# EAGLE board Speed Reg (EAGLE 5.11), part 1 of 2
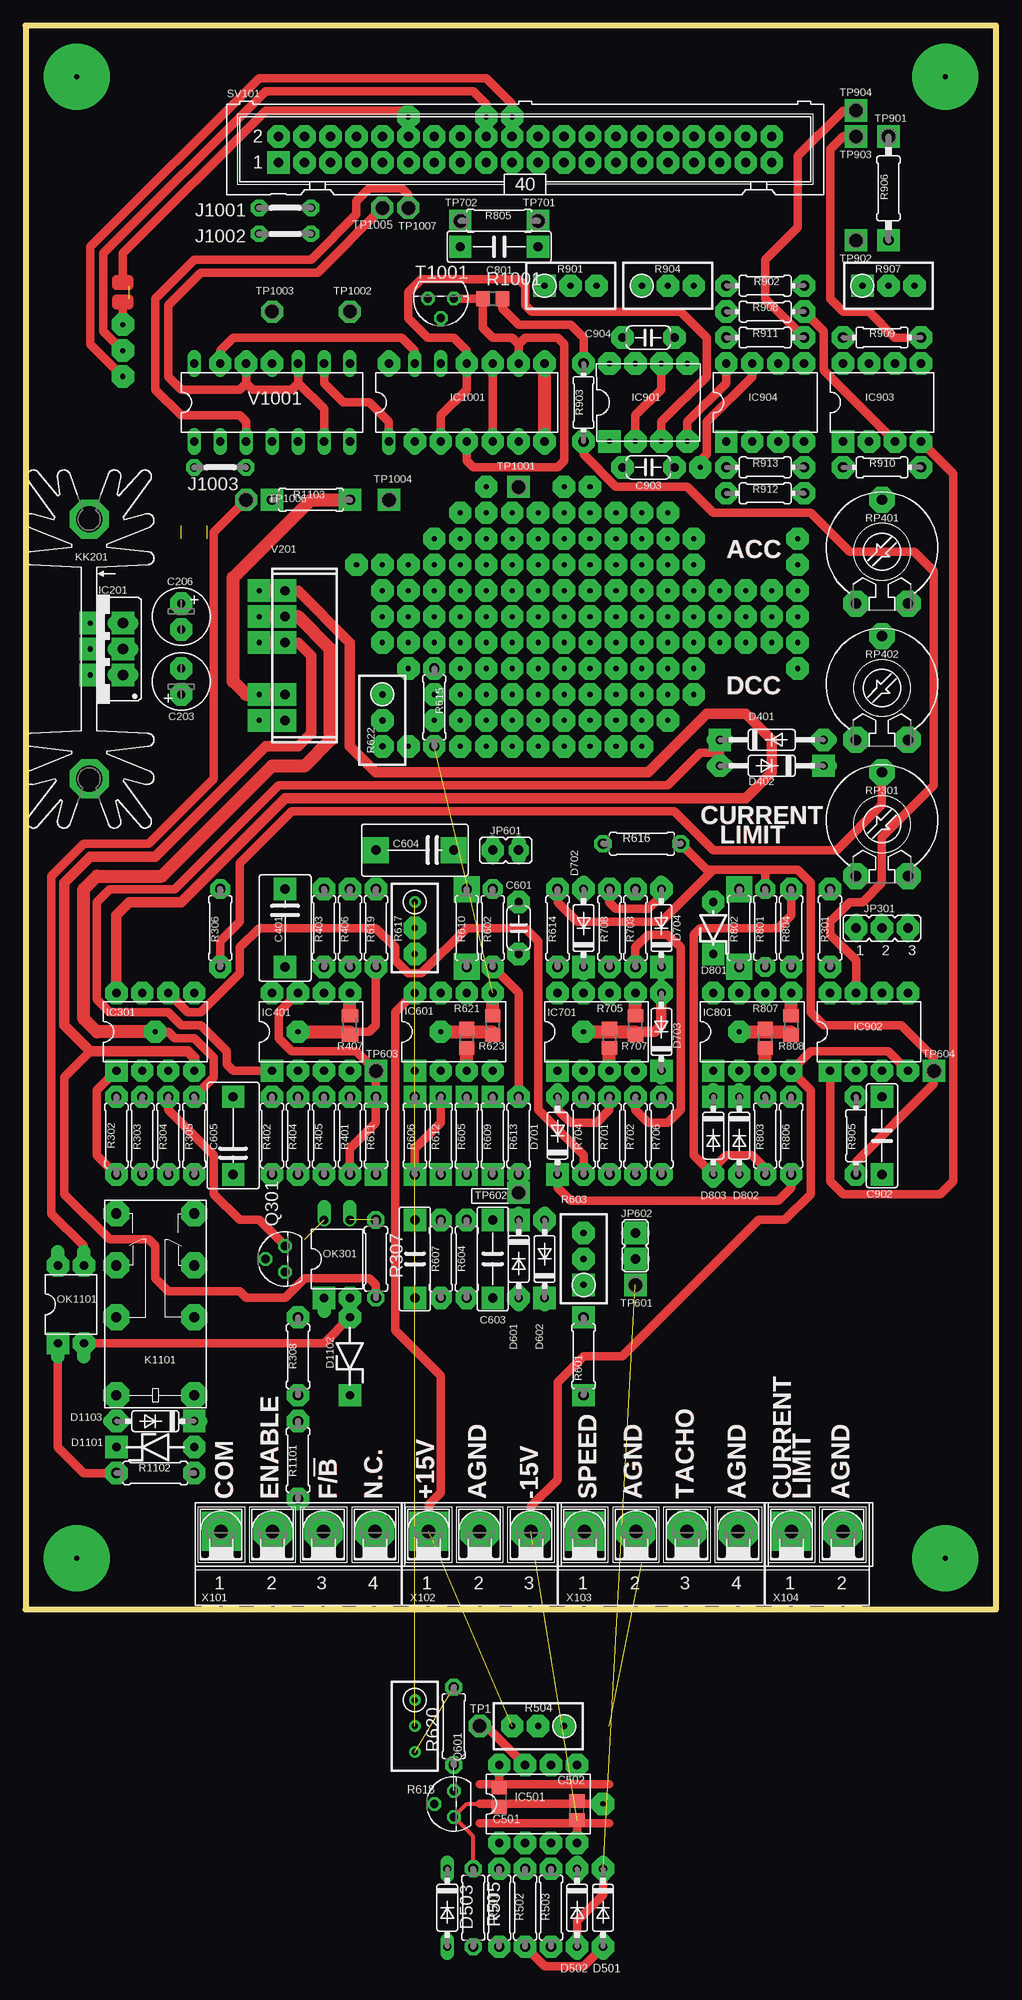
[diagram p11: board, top side]
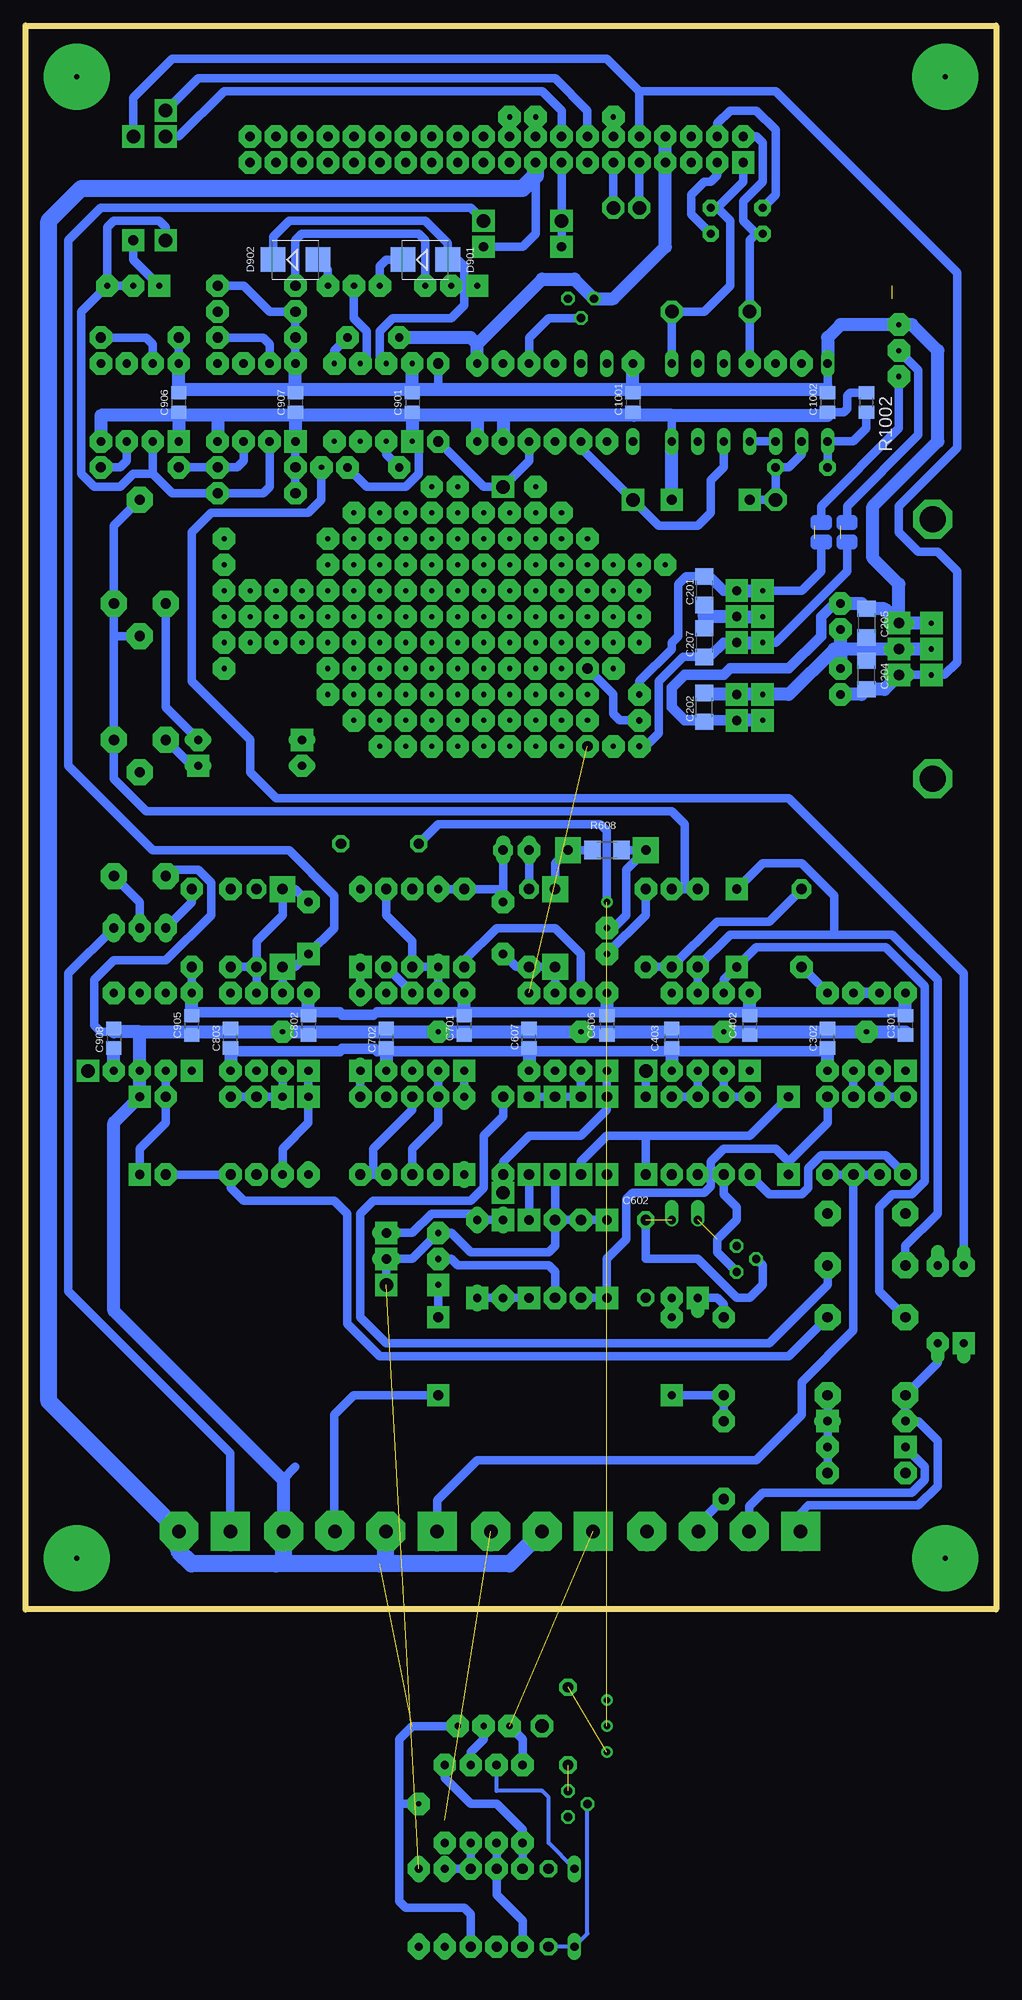
[diagram p12: board, bottom side, seen from below]

Size 95 x 155 mm. Coordinates in mm from the lower left corner, seen from the top.
Outline: 0,0 95,0 95,155 0,155 0,0
Copper layers (1*16): Top 0.035mm / dielectric 1.5mm / Bottom 0.035mm
Design rules "default": minimum track width 10mil, minimum drill 24mil, track to track 8mil, track to pad 8mil, pad to pad 8mil, via to via 8mil, smd to smd 8mil, copper to edge 40mil, drill to drill 8mil, minimum pad ring 10mil, minimum via ring 8mil, stop-mask expansion 4mil, vias tented up to drill 0mil, thermal gap 10mil

## Footprints (pad centres in the part's own frame; a part is rotated, then mirrored left to right if it is on the bottom)
C1206 = smd 1.6 x 1.8: 1 -1.4,0; 2 1.4,0
E2,5-6 = drill 0.813 pad 1.6 round: + -1.27,0 | drill 0.813 pad 1.6 octagon: - 1.27,0
C0805 = smd 1.3 x 1.5: 1 -0.95,0; 2 0.95,0
C075-052X106 = drill 0.914 octagon: 1 -3.81,0; 2 3.81,0
C050-024X044 = drill 0.813 octagon: 1 -2.54,0; 2 2.54,0
C075-032X103 = drill 0.914 octagon: 1 -3.81,0; 2 3.81,0
DO35-10 = drill 0.813 long: A 5.08,0; C -5.08,0
DO35-7 = drill 0.813 long: A 3.81,0; C -3.81,0
ZDIO-5 = drill 0.813 octagon: A 2.54,0; C -2.54,0
SMB = smd 2.4 x 2.4: A 2.2,0; C -2.2,0
ZDIO-7.5 = drill 0.813 octagon: A 3.81,0; C -3.81,0
78XXS = drill 1.016 long: GND 0,-2.54; IN -2.54,-2.54; OUT 2.54,-2.54
DIL08 = drill 0.813 pad 1.27 round: 1 -3.81,-3.81; 2 -1.27,-3.81; 3 1.27,-3.81; 4 3.81,-3.81; 5 3.81,3.81; 6 1.27,3.81; 7 -1.27,3.81; 8 -3.81,3.81
DIL8-HOME = drill 0.5 pad 2.184 square: 1 -3.81,-3.81 | drill 0.5 pad 2.184 octagon: 2 -1.27,-3.81; 3 1.27,-3.81; 4 3.81,-3.81; 5 3.81,3.81; 6 1.27,3.81; 7 -1.27,3.81; 8 -3.81,3.81
DIL14 = drill 0.813 long: 1 -7.62,-3.81; 2 -5.08,-3.81; 3 -2.54,-3.81; 4 0,-3.81; 5 2.54,-3.81; 6 5.08,-3.81; 7 7.62,-3.81; 8 7.62,3.81; 9 5.08,3.81; 10 2.54,3.81; 11 0,3.81; 12 -2.54,3.81; 13 -5.08,3.81; 14 -7.62,3.81
05 = drill 0.813 pad 1.6 octagon: 1 -2.54,0; 2 2.54,0
JP2 = drill 0.914 long: 1 -2.54,0; 2 0,0; 3 2.54,0
JP1 = drill 0.914 long: 1 0,-1.27; 2 0,1.27
G5V-2 = drill 1 pad 1.8 round: 1 -8.89,-3.81; 4 -1.27,-3.81; 6 3.81,-3.81; 8 8.89,-3.81; 9 8.89,3.81; 11 3.81,3.81; 13 -1.27,3.81; 16 -8.89,3.81
SK104-PAD = drill 2.54 pad 3.81 round: K1 -12.7,-0.762; K2 12.7,-0.762
DIL04 = drill 0.813 offset: 1 -1.27,-3.81; 2 1.27,-3.81; 3 1.27,3.81; 4 -1.27,3.81
TO92 = drill 0.813 octagon: 1 1.27,0; 2 0,1.905; 3 -1.27,0
0207/7 = drill 1 pad 1.676 octagon: 1 -3.81,0; 2 3.81,0
M0805 = smd 1.3 x 1.6: 1 -0.95,0; 2 0.95,0
RTRIM3296W = drill 0.61 round: 1 0,-2.54; 2 0,0; 3 0,2.54
R1206 = smd 1.6 x 1.803: 1 -1.422,0; 2 1.422,0
R0805 = smd 1.3 x 1.5: 1 -0.95,0; 2 0.95,0
0204/7 = drill 1 octagon: 1 -3.81,0; 2 3.81,0
0207/10 = drill 1 octagon: 1 -5.08,0; 2 5.08,0
PT-10 = drill 1.016 pad 1.778 octagon: 1 -2.54,-5.08; 2 2.54,-5.08; 3 0,5.08
ML40 = drill 0.914 octagon: 1 -24.13,-1.27; 2 -24.13,1.27; 3 -21.59,-1.27; 4 -21.59,1.27; 5 -19.05,-1.27; 6 -19.05,1.27; 7 -16.51,-1.27; 8 -16.51,1.27; 9 -13.97,-1.27; 10 -13.97,1.27; 11 -11.43,-1.27; 12 -11.43,1.27; 13 -8.89,-1.27; 14 -8.89,1.27; 15 -6.35,-1.27; 16 -6.35,1.27; 17 -3.81,-1.27; 18 -3.81,1.27; 19 -1.27,-1.27; 20 -1.27,1.27; 21 1.27,-1.27; 22 1.27,1.27; 23 3.81,-1.27; 24 3.81,1.27; 25 6.35,-1.27; 26 6.35,1.27; 27 8.89,-1.27; 28 8.89,1.27; 29 11.43,-1.27; 30 11.43,1.27; 31 13.97,-1.27; 32 13.97,1.27; 33 16.51,-1.27; 34 16.51,1.27; 35 19.05,-1.27; 36 19.05,1.27; 37 21.59,-1.27; 38 21.59,1.27; 39 24.13,-1.27; 40 24.13,1.27
P1-13 = drill 1.321 pad 2.159 octagon: TP 0,0
TMA_DUAL = drill 0.9 round: 1 -5.08,0; 2 -2.54,0; 5 2.54,0; 6 5.08,0; 7 7.62,0
AK500/4-H = drill 1.321 long: 1 -7.518,0; 2 -2.489,0; 3 2.489,0; 4 7.518,0
AK500/3-H = drill 1.321 long: 1 -5.004,0; 2 0,0; 3 5.004,0
AK500/2-H = drill 1.321 long: 1 -2.515,0; 2 2.515,0

## Placement (x,y rotation side)
C201  [C1206]  28.57,99.69 270 bottom
C202  [C1206]  28.57,88.27 90 bottom
C203  [E2,5-6]  15.24,90.81 90 top
C204  [C1206]  12.7,91.44 90 bottom
C205  [C1206]  12.7,96.52 270 bottom
C206  [E2,5-6]  15.24,97.16 270 top
C207  [C1206]  28.57,94.61 270 bottom
C301  100nF  [C0805]  8.89,57.15 270 bottom
C302  100nF  [C0805]  16.51,55.88 90 bottom
C401  1uF  [C075-052X106]  25.4,66.67 270 top
C402  100nF  [C0805]  24.13,57.15 270 bottom
C403  100nF  [C0805]  31.75,55.88 90 bottom
C501  100nF  [C0805]  46.35,-18.41 270 top  (outside the outline)
C502  100nF  [C0805]  53.98,-19.68 90 top  (outside the outline)
C601  3.3nF  [C050-024X044]  48.26,66.67 90 top
C602  220nF  [C075-032X103]  38.1,34.29 90 top
C603  10nF  [C075-032X103]  45.72,34.29 90 top
C604  200nF  [C075-052X106]  38.1,74.3 180 top
C605  1uF  [C075-052X106]  20.32,46.35 90 top
C606  100nF  [C0805]  38.1,57.15 270 bottom
C607  100nF  [C0805]  45.72,55.88 90 bottom
C701  100nF  [C0805]  52.07,57.15 270 bottom
C702  100nF  [C0805]  59.69,55.88 90 bottom
C801  220nF  [C075-032X103]  46.35,133.35 0 top
C802  100nF  [C0805]  67.31,57.15 270 bottom
C803  100nF  [C0805]  74.93,55.88 90 bottom
C901  100nF  [C0805]  57.15,118.11 270 bottom
C902  100nF  [C075-032X103]  83.82,46.35 90 top
C903  22nF  [C050-024X044]  60.96,111.76 0 top
C904  22nF  [C050-024X044]  60.96,124.46 180 top
C905  100nF  [C0805]  78.74,57.15 270 bottom
C906  100nF  [C0805]  80.01,118.11 270 bottom
C907  100nF  [C0805]  68.58,118.11 270 bottom
C908  100nF  [C0805]  86.36,55.88 270 bottom
C1001  100nF  [C0805]  35.56,118.11 270 bottom
C1002  100nF  [C0805]  16.51,118.11 270 bottom
D401  1N4148  [DO35-10]  73.03,85.09 0 top
D402  1N4148  [DO35-10]  73.03,82.55 180 top
D501  1N4148  [DO35-7]  56.52,-29.21 270 top  (outside the outline)
D502  1N4148  [DO35-7]  53.98,-29.21 270 top  (outside the outline)
D503  1N4148  [DO35-7]  41.27,-29.21 270 top  (outside the outline)
D601  1N4148  [DO35-7]  48.26,34.29 270 top
D602  1N4148  [DO35-7]  50.8,34.29 90 top
D701  1N4148  [DO35-7]  52.07,46.35 90 top
D702  1N4148  [DO35-7]  54.61,66.67 90 top
D703  1N4148  [DO35-7]  62.23,56.52 90 top
D704  1N4148  [DO35-7]  62.23,66.67 90 top
D801  10V1  [ZDIO-5]  67.31,66.67 90 top
D802  1N4148  [DO35-7]  69.85,46.35 270 top
D803  1N4148  [DO35-7]  67.31,46.35 270 top
D901  SS14  [SMB]  55.88,132.08 0 bottom
D902  SS14  [SMB]  68.58,132.08 0 bottom
D1101  12V  [ZDIO-7.5]  12.7,15.88 0 top
D1102  12V  [ZDIO-7.5]  31.75,24.77 90 top
D1103  1N4148  [DO35-7]  12.7,18.41 180 top
IC201  [78XXS]  6.99,93.98 90 top
IC301  TL082P  [DIL08]  12.7,56.52 0 top
IC401  TL082P  [DIL08]  27.94,56.52 0 top
IC501  TL082P  [DIL08]  50.16,-19.05 0 top  (outside the outline)
IC601  TL082P  [DIL08]  41.91,56.52 0 top
IC701  TL082P  [DIL08]  55.88,56.52 0 top
IC801  TL082P  [DIL08]  71.12,56.52 0 top
IC901  LM555  [DIL8-HOME]  60.96,118.11 0 top
IC902  LM311N  [DIL08]  82.55,56.52 0 top
IC903  LM311N  [DIL08]  83.82,118.11 0 top
IC904  LM311N  [DIL08]  72.39,118.11 0 top
IC1001  4013N  [DIL14]  43.18,118.11 0 top
J1001  J5MM  [05]  25.4,137.16 180 top
J1002  J5MM  [05]  25.4,134.62 0 top
J1003  J5MM  [05]  19.05,111.76 180 top
JP301  [JP2]  83.82,66.67 0 top
JP601  [JP1]  46.99,74.3 270 top
JP602  [JP1]  59.69,35.56 0 top
K1101  G5V-2  [G5V-2]  12.7,29.84 90 top
KK201  SK104-PAD  [SK104-PAD]  6.99,93.98 270 top
OK301  PC817  [DIL04]  30.48,34.29 0 top
OK1101  PC817  [DIL04]  4.45,29.84 0 top
Q301  2N3819  [TO92]  25.4,34.29 90 top
Q601  2N3819  [TO92]  41.91,-19.05 90 top  (outside the outline)
R301  2.4K  [0207/7]  78.74,66.67 270 top
R302  51K  [0207/7]  8.89,46.35 270 top
R303  51K  [0207/7]  11.43,46.35 90 top
R304  51K  [0207/7]  13.97,46.35 90 top
R305  10K  [0207/7]  16.51,46.35 270 top
R306  51K  [0207/7]  19.05,66.67 270 top
R307  20K  [0207/7]  34.29,34.29 270 top
R308  560  [0207/7]  26.67,24.77 90 top
R401  1.3K  [0207/7]  31.75,46.35 270 top
R402  1.3K  [0207/7]  24.13,46.35 90 top
R403  220K  [0207/7]  29.21,66.67 270 top
R404  10K  [0207/7]  26.67,46.35 90 top
R405  10K  [0207/7]  29.21,46.35 90 top
R406  1.3K  [0207/7]  31.75,66.67 90 top
R407  10K  [M0805]  31.75,57.15 90 top
R501  10K  [0207/7]  46.35,-29.21 90 top  (outside the outline)
R502  10K  [0207/7]  48.9,-29.21 90 top  (outside the outline)
R503  5.1K  [0207/7]  51.44,-29.21 90 top  (outside the outline)
R504  50K  [RTRIM3296W]  50.16,-11.43 90 top  (outside the outline)
R505  10K  [0207/7]  43.81,-29.21 270 top  (outside the outline)
R601  0R0 (2.7K)  [0207/7]  54.61,24.77 270 top
R602  20K  [0207/7]  45.72,66.67 90 top
R603  10K  [RTRIM3296W]  54.61,34.29 0 top
R604  3.9K  [0207/7]  43.18,34.29 90 top
R605  20K (10K*)  [0207/7]  43.18,46.35 90 top
R606  20K  [0207/7]  38.1,46.35 90 top
R607  2.7K  [0207/7]  40.64,34.29 90 top
R608  >=5.1M  [R1206]  38.1,74.3 0 bottom
R609  10K  [0207/7]  45.72,46.35 90 top
R610  220K  [0207/7]  43.18,66.67 90 top
R611  10K  [0207/7]  34.29,46.35 270 top
R612  10K  [0207/7]  40.64,46.35 90 top
R613  20K  [0207/7]  48.26,46.35 90 top
R614  2.7K  [0207/7]  52.07,66.67 90 top
R615  1M  [0207/7]  40.01,88.27 270 top
R616  5.1K  [0207/7]  60.33,74.93 0 top
R617  10K  [RTRIM3296W]  38.1,66.67 180 top
R618  10K  [RTRIM3296W]  38.1,-11.43 180 top  (outside the outline)
R619  2.7K  [0207/7]  34.29,66.67 90 top
R620  2.7K  [0207/7]  41.91,-11.43 90 top  (outside the outline)
R621  20K  [R0805]  43.18,55.88 270 top
R622  10K  [RTRIM3296W]  34.92,87 180 top
R623  2.7K  [R0805]  45.72,57.15 90 top
R701  10K  [0207/7]  57.15,46.35 90 top
R702  10K  [0207/7]  59.69,46.35 90 top
R703  10K  [0207/7]  59.69,66.67 90 top
R704  10K  [0207/7]  54.61,46.35 90 top
R705  10K  [R0805]  57.15,55.88 270 top
R706  10K  [0207/7]  62.23,46.35 270 top
R707  10K  [R0805]  59.69,57.15 90 top
R708  10K  [0207/7]  57.15,66.67 270 top
R801  20K  [0207/7]  72.39,66.67 270 top
R802  20K  [0207/7]  69.85,66.67 270 top
R803  10K  [0207/7]  72.39,46.35 270 top
R804  10K  [0207/7]  74.93,66.67 270 top
R805  1.3K  [0207/7]  46.35,135.89 180 top
R806  10K  [0207/7]  74.93,46.35 90 top
R807  10K  [R0805]  72.39,55.88 270 top
R808  10K  [R0805]  74.93,57.15 90 top
R901  2K  [RTRIM3296W]  53.34,129.54 270 top
R902  510  [0204/7]  72.39,129.54 0 top
R903  5.1K  [0204/7]  54.61,118.11 90 top
R904  2K  [RTRIM3296W]  62.87,129.54 270 top
R905  1.3K  [0204/7]  81.28,46.35 270 top
R906  10K  [0207/10]  84.45,139.06 90 top
R907  10K  [RTRIM3296W]  84.45,129.54 270 top
R908  10K  [0204/7]  72.39,127 180 top
R909  5.1K  [0204/7]  83.82,124.46 180 top
R910  1.3K  [0204/7]  83.82,111.76 0 top
R911  1K  [0204/7]  72.39,124.46 180 top
R912  2.7K  [0204/7]  72.39,109.22 0 top
R913  10K  [0204/7]  72.39,111.76 0 top
R1001  5.1K  [R0805]  45.72,128.27 0 top
R1002  5.1K  [R0805]  12.7,118.11 270 bottom
R1101  470  [0207/7]  26.67,14.61 90 top
R1102  5.1K  [0207/7]  12.7,13.34 180 top
R1103  10K  [0207/7]  27.94,108.58 180 top
RP301  5.7K  [PT-10]  83.82,76.83 0 top
RP401  5.7K  [PT-10]  83.82,103.5 0 top
RP402  5.7K  [PT-10]  83.82,90.17 0 top
SV101  [ML40]  48.9,142.88 0 top
T1001  BC547  [TO92]  40.64,128.27 180 top
TP1  TPPAD1-13  [P1-13]  44.45,-11.43 0 top  (outside the outline)
TP601  TPPAD1-13  [P1-13]  59.69,31.75 0 top
TP602  TPPAD1-13  [P1-13]  48.26,40.77 0 top
TP603  TPPAD1-13  [P1-13]  34.29,52.7 0 top
TP604  TPPAD1-13  [P1-13]  88.9,52.7 0 top
TP701  TPPAD1-13  [P1-13]  50.16,135.89 0 top
TP702  TPPAD1-13  [P1-13]  42.55,135.89 0 top
TP901  TPPAD1-13  [P1-13]  84.45,144.15 0 top
TP902  TPPAD1-13  [P1-13]  81.28,133.99 0 top
TP903  TPPAD1-13  [P1-13]  81.28,144.15 0 top
TP904  TPPAD1-13  [P1-13]  81.28,146.69 0 top
TP1001  TPPAD1-13  [P1-13]  48.26,109.86 0 top
TP1002  TPPAD1-13  [P1-13]  31.75,127 90 top
TP1003  TPPAD1-13  [P1-13]  24.13,127 90 top
TP1004  TPPAD1-13  [P1-13]  35.56,108.58 0 top
TP1005  TPPAD1-13  [P1-13]  34.92,137.16 0 top
TP1006  TPPAD1-13  [P1-13]  21.59,108.58 0 top
TP1007  TPPAD1-13  [P1-13]  37.47,137.16 90 top
V201  AM1D-0515DZ  [TMA_DUAL]  25.4,92.08 90 top
V1001  7408N  [DIL14]  24.13,118.11 0 top
X101  [AK500/4-H]  26.67,7.62 0 top
X102  [AK500/3-H]  44.45,7.62 0 top
X103  [AK500/4-H]  62.23,7.62 0 top
X104  [AK500/2-H]  77.47,7.62 0 top